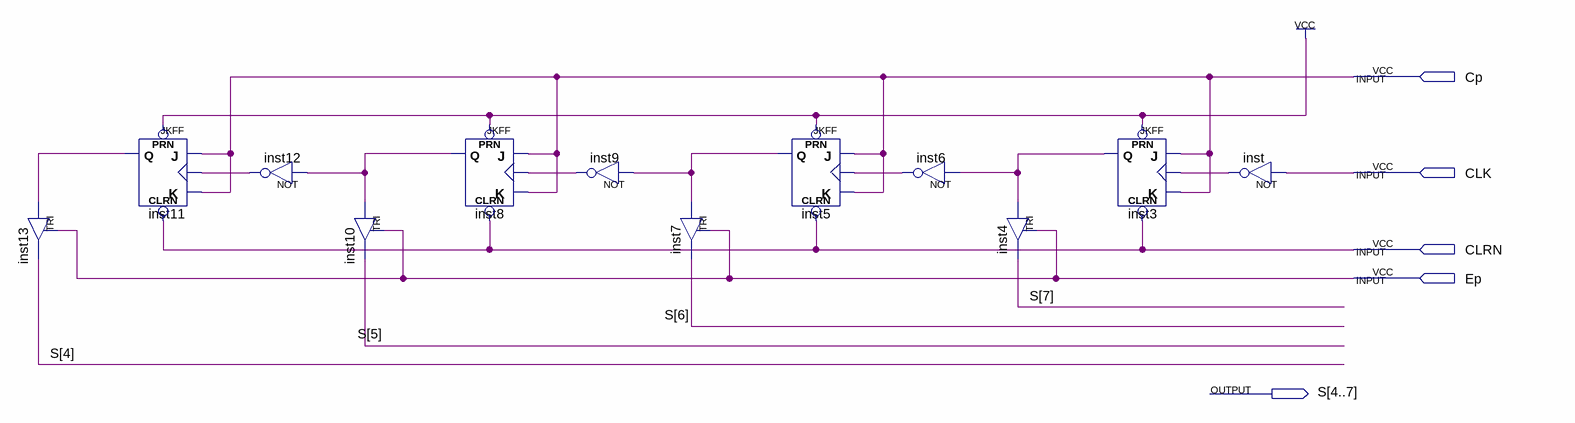
[diagram p0: schematic sheet]
// Quartus schematic PC.bdf as structural Verilog: 12 symbols, 5 pins
module PC (
  input  Cp,
  input  CLK,
  input  CLRN,
  input  Ep,
  output [4:7] S
);

  wire inst3_q, inst5_q, inst6_out, inst8_q, inst9_out, inst11_q, inst12_out, inst_out;

  TRI inst13 (.IN(inst11_q), .OE(Ep), .OUT(S[4]));
  JKFF inst11 (.PRN(1'b1), .CLRN(CLRN), .K(Cp), .J(Cp), .CLK(inst12_out), .Q(inst11_q));
  not inst12 (inst12_out, inst8_q);
  TRI inst10 (.IN(inst8_q), .OE(Ep), .OUT(S[5]));
  JKFF inst8 (.PRN(1'b1), .CLRN(CLRN), .K(Cp), .J(Cp), .CLK(inst9_out), .Q(inst8_q));
  not inst9 (inst9_out, inst5_q);
  TRI inst7 (.IN(inst5_q), .OE(Ep), .OUT(S[6]));
  JKFF inst5 (.PRN(1'b1), .CLRN(CLRN), .K(Cp), .J(Cp), .CLK(inst6_out), .Q(inst5_q));
  not inst6 (inst6_out, inst3_q);
  TRI inst4 (.IN(inst3_q), .OE(Ep), .OUT(S[7]));
  JKFF inst3 (.PRN(1'b1), .CLRN(CLRN), .K(Cp), .J(Cp), .CLK(inst_out), .Q(inst3_q));
  not inst (inst_out, CLK);
endmodule
